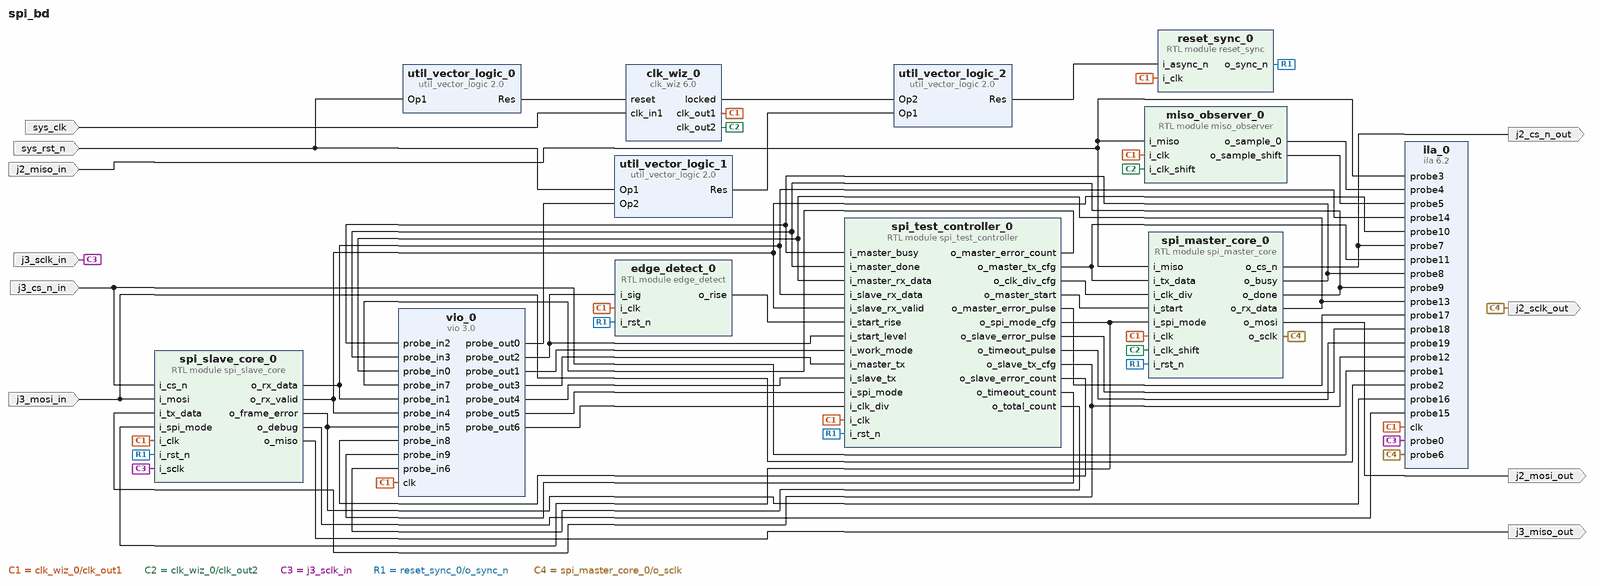
[diagram p0: block diagram of the top level]
# Vivado block design spi_bd, xc7a35tfgg484-2, Vivado 2024.1
create_bd_design spi_bd

create_bd_port -dir I -type clk sys_clk
set_property -dict {CONFIG.FREQ_HZ 50000000} [get_bd_ports sys_clk]
create_bd_port -dir I -type rst sys_rst_n
create_bd_port -dir O j2_sclk_out
create_bd_port -dir O j2_cs_n_out
create_bd_port -dir O j2_mosi_out
create_bd_port -dir I j2_miso_in
create_bd_port -dir I j3_sclk_in
create_bd_port -dir I j3_cs_n_in
create_bd_port -dir I j3_mosi_in
create_bd_port -dir O j3_miso_out

create_bd_cell -type module -reference reset_sync reset_sync_0
create_bd_cell -type module -reference edge_detect edge_detect_0
create_bd_cell -type module -reference spi_master_core spi_master_core_0
create_bd_cell -type module -reference spi_slave_core spi_slave_core_0
create_bd_cell -type module -reference spi_test_controller spi_test_controller_0
create_bd_cell -type ip -vlnv xilinx.com:ip:clk_wiz:6.0 clk_wiz_0
set_property -dict [list \
  CONFIG.CLKIN1_JITTER_PS 200.0 \
  CONFIG.CLKOUT1_JITTER 575.295 \
  CONFIG.CLKOUT1_PHASE_ERROR 919.522 \
  CONFIG.CLKOUT1_REQUESTED_OUT_FREQ 160.000 \
  CONFIG.CLKOUT2_JITTER 575.295 \
  CONFIG.CLKOUT2_PHASE_ERROR 919.522 \
  CONFIG.CLKOUT2_REQUESTED_OUT_FREQ 160.000 \
  CONFIG.CLKOUT2_REQUESTED_PHASE 237.000 \
  CONFIG.CLKOUT2_USED true \
  CONFIG.MMCM_CLKFBOUT_MULT_F 64.000 \
  CONFIG.MMCM_CLKIN1_PERIOD 20.000 \
  CONFIG.MMCM_CLKIN2_PERIOD 10.000 \
  CONFIG.MMCM_CLKOUT0_DIVIDE_F 4.000 \
  CONFIG.MMCM_CLKOUT1_DIVIDE 4 \
  CONFIG.MMCM_CLKOUT1_PHASE 236.250 \
  CONFIG.MMCM_DIVCLK_DIVIDE 5 \
  CONFIG.NUM_OUT_CLKS 2 \
  CONFIG.PRIM_IN_FREQ 50.000 \
] [get_bd_cells clk_wiz_0]
create_bd_cell -type ip -vlnv xilinx.com:ip:vio:3.0 vio_0
set_property -dict [list \
  CONFIG.C_NUM_PROBE_IN 10 \
  CONFIG.C_NUM_PROBE_OUT 7 \
  CONFIG.C_PROBE_OUT1_WIDTH 2 \
  CONFIG.C_PROBE_OUT3_WIDTH 8 \
  CONFIG.C_PROBE_OUT4_WIDTH 8 \
  CONFIG.C_PROBE_OUT5_WIDTH 2 \
  CONFIG.C_PROBE_OUT6_WIDTH 16 \
] [get_bd_cells vio_0]
create_bd_cell -type ip -vlnv xilinx.com:ip:ila:6.2 ila_0
set_property -dict [list \
  CONFIG.C_DATA_DEPTH 2048 \
  CONFIG.C_MONITOR_TYPE Native \
  CONFIG.C_NUM_OF_PROBES 20 \
  CONFIG.C_PROBE11_WIDTH 8 \
  CONFIG.C_PROBE12_WIDTH 8 \
  CONFIG.C_PROBE13_WIDTH 8 \
  CONFIG.C_PROBE14_WIDTH 8 \
  CONFIG.C_PROBE15_WIDTH 8 \
] [get_bd_cells ila_0]
create_bd_cell -type ip -vlnv xilinx.com:ip:util_vector_logic:2.0 util_vector_logic_0
set_property -dict {CONFIG.C_OPERATION not CONFIG.C_SIZE 1} [get_bd_cells util_vector_logic_0]
create_bd_cell -type ip -vlnv xilinx.com:ip:util_vector_logic:2.0 util_vector_logic_1
set_property -dict {CONFIG.C_SIZE 1} [get_bd_cells util_vector_logic_1]
create_bd_cell -type ip -vlnv xilinx.com:ip:util_vector_logic:2.0 util_vector_logic_2
set_property -dict {CONFIG.C_SIZE 1} [get_bd_cells util_vector_logic_2]
create_bd_cell -type module -reference miso_observer miso_observer_0

# ---- connections ----

connect_bd_net -net clk_in1_0_1 [get_bd_ports sys_clk] [get_bd_pins clk_wiz_0/clk_in1]
connect_bd_net [get_bd_pins clk_wiz_0/clk_out1] \
  [get_bd_pins spi_master_core_0/i_clk] [get_bd_pins spi_slave_core_0/i_clk] [get_bd_pins edge_detect_0/i_clk] \
  [get_bd_pins spi_test_controller_0/i_clk] [get_bd_pins reset_sync_0/i_clk] [get_bd_pins vio_0/clk] [get_bd_pins ila_0/clk] \
  [get_bd_pins miso_observer_0/i_clk]
connect_bd_net [get_bd_pins clk_wiz_0/clk_out2] [get_bd_pins spi_master_core_0/i_clk_shift] [get_bd_pins miso_observer_0/i_clk_shift]
connect_bd_net [get_bd_pins clk_wiz_0/locked] [get_bd_pins util_vector_logic_2/Op2]
connect_bd_net [get_bd_pins edge_detect_0/o_rise] [get_bd_pins spi_test_controller_0/i_start_rise]
connect_bd_net [get_bd_ports j2_miso_in] [get_bd_pins spi_master_core_0/i_miso] [get_bd_pins miso_observer_0/i_miso] [get_bd_pins ila_0/probe3]
connect_bd_net [get_bd_ports j3_cs_n_in] [get_bd_pins spi_slave_core_0/i_cs_n] [get_bd_pins ila_0/probe1]
connect_bd_net [get_bd_ports j3_mosi_in] [get_bd_pins spi_slave_core_0/i_mosi] [get_bd_pins ila_0/probe2]
connect_bd_net [get_bd_ports j3_sclk_in] [get_bd_pins spi_slave_core_0/i_sclk] [get_bd_pins ila_0/probe0]
connect_bd_net [get_bd_pins miso_observer_0/o_sample_0] [get_bd_pins ila_0/probe4]
connect_bd_net [get_bd_pins miso_observer_0/o_sample_shift] [get_bd_pins ila_0/probe5]
connect_bd_net [get_bd_pins reset_sync_0/o_sync_n] \
  [get_bd_pins edge_detect_0/i_rst_n] [get_bd_pins spi_test_controller_0/i_rst_n] [get_bd_pins spi_master_core_0/i_rst_n] \
  [get_bd_pins spi_slave_core_0/i_rst_n]
connect_bd_net [get_bd_pins spi_master_core_0/o_busy] \
  [get_bd_pins spi_test_controller_0/i_master_busy] [get_bd_pins vio_0/probe_in2] [get_bd_pins ila_0/probe8]
connect_bd_net [get_bd_pins spi_master_core_0/o_cs_n] [get_bd_ports j2_cs_n_out] [get_bd_pins ila_0/probe7]
connect_bd_net [get_bd_pins spi_master_core_0/o_done] \
  [get_bd_pins spi_test_controller_0/i_master_done] [get_bd_pins vio_0/probe_in3] [get_bd_pins ila_0/probe9]
connect_bd_net [get_bd_pins spi_master_core_0/o_mosi] [get_bd_ports j2_mosi_out]
connect_bd_net [get_bd_pins spi_master_core_0/o_rx_data] \
  [get_bd_pins spi_test_controller_0/i_master_rx_data] [get_bd_pins vio_0/probe_in0] [get_bd_pins ila_0/probe13]
connect_bd_net [get_bd_pins spi_master_core_0/o_sclk] [get_bd_ports j2_sclk_out] [get_bd_pins ila_0/probe6]
connect_bd_net [get_bd_pins spi_slave_core_0/o_debug] [get_bd_pins ila_0/probe15]
connect_bd_net [get_bd_pins spi_slave_core_0/o_frame_error] [get_bd_pins vio_0/probe_in5] [get_bd_pins ila_0/probe16]
connect_bd_net [get_bd_pins spi_slave_core_0/o_miso] [get_bd_ports j3_miso_out]
connect_bd_net [get_bd_pins spi_slave_core_0/o_rx_data] \
  [get_bd_pins spi_test_controller_0/i_slave_rx_data] [get_bd_pins vio_0/probe_in1] [get_bd_pins ila_0/probe14]
connect_bd_net [get_bd_pins spi_slave_core_0/o_rx_valid] \
  [get_bd_pins spi_test_controller_0/i_slave_rx_valid] [get_bd_pins vio_0/probe_in4] [get_bd_pins ila_0/probe10]
connect_bd_net [get_bd_pins spi_test_controller_0/o_clk_div_cfg] [get_bd_pins spi_master_core_0/i_clk_div]
connect_bd_net [get_bd_pins spi_test_controller_0/o_master_error_count] [get_bd_pins vio_0/probe_in7]
connect_bd_net [get_bd_pins spi_test_controller_0/o_master_error_pulse] [get_bd_pins ila_0/probe17]
connect_bd_net [get_bd_pins spi_test_controller_0/o_master_start] [get_bd_pins spi_master_core_0/i_start]
connect_bd_net [get_bd_pins spi_test_controller_0/o_master_tx_cfg] [get_bd_pins spi_master_core_0/i_tx_data] [get_bd_pins ila_0/probe11]
connect_bd_net [get_bd_pins spi_test_controller_0/o_slave_error_count] [get_bd_pins vio_0/probe_in8]
connect_bd_net [get_bd_pins spi_test_controller_0/o_slave_error_pulse] [get_bd_pins ila_0/probe18]
connect_bd_net [get_bd_pins spi_test_controller_0/o_slave_tx_cfg] [get_bd_pins spi_slave_core_0/i_tx_data] [get_bd_pins ila_0/probe12]
connect_bd_net [get_bd_pins spi_test_controller_0/o_spi_mode_cfg] [get_bd_pins spi_slave_core_0/i_spi_mode] [get_bd_pins spi_master_core_0/i_spi_mode]
connect_bd_net [get_bd_pins spi_test_controller_0/o_timeout_count] [get_bd_pins vio_0/probe_in9]
connect_bd_net [get_bd_pins spi_test_controller_0/o_timeout_pulse] [get_bd_pins ila_0/probe19]
connect_bd_net [get_bd_pins spi_test_controller_0/o_total_count] [get_bd_pins vio_0/probe_in6]
connect_bd_net [get_bd_ports sys_rst_n] [get_bd_pins util_vector_logic_0/Op1] [get_bd_pins util_vector_logic_1/Op1]
connect_bd_net [get_bd_pins util_vector_logic_0/Res] [get_bd_pins clk_wiz_0/reset]
connect_bd_net [get_bd_pins util_vector_logic_1/Res] [get_bd_pins util_vector_logic_2/Op1]
connect_bd_net [get_bd_pins util_vector_logic_2/Res] [get_bd_pins reset_sync_0/i_async_n]
connect_bd_net [get_bd_pins vio_0/probe_out0] [get_bd_pins util_vector_logic_1/Op2]
connect_bd_net [get_bd_pins vio_0/probe_out1] [get_bd_pins spi_test_controller_0/i_work_mode]
connect_bd_net [get_bd_pins vio_0/probe_out2] [get_bd_pins edge_detect_0/i_sig] [get_bd_pins spi_test_controller_0/i_start_level]
connect_bd_net [get_bd_pins vio_0/probe_out3] [get_bd_pins spi_test_controller_0/i_master_tx]
connect_bd_net [get_bd_pins vio_0/probe_out4] [get_bd_pins spi_test_controller_0/i_slave_tx]
connect_bd_net [get_bd_pins vio_0/probe_out5] [get_bd_pins spi_test_controller_0/i_spi_mode]
connect_bd_net [get_bd_pins vio_0/probe_out6] [get_bd_pins spi_test_controller_0/i_clk_div]

validate_bd_design
save_bd_design
